# Altium schematic sheet BUTTON_LED.SchDoc
size 420 x 297 mm; SheetNumber: 22; SheetTotal: 23
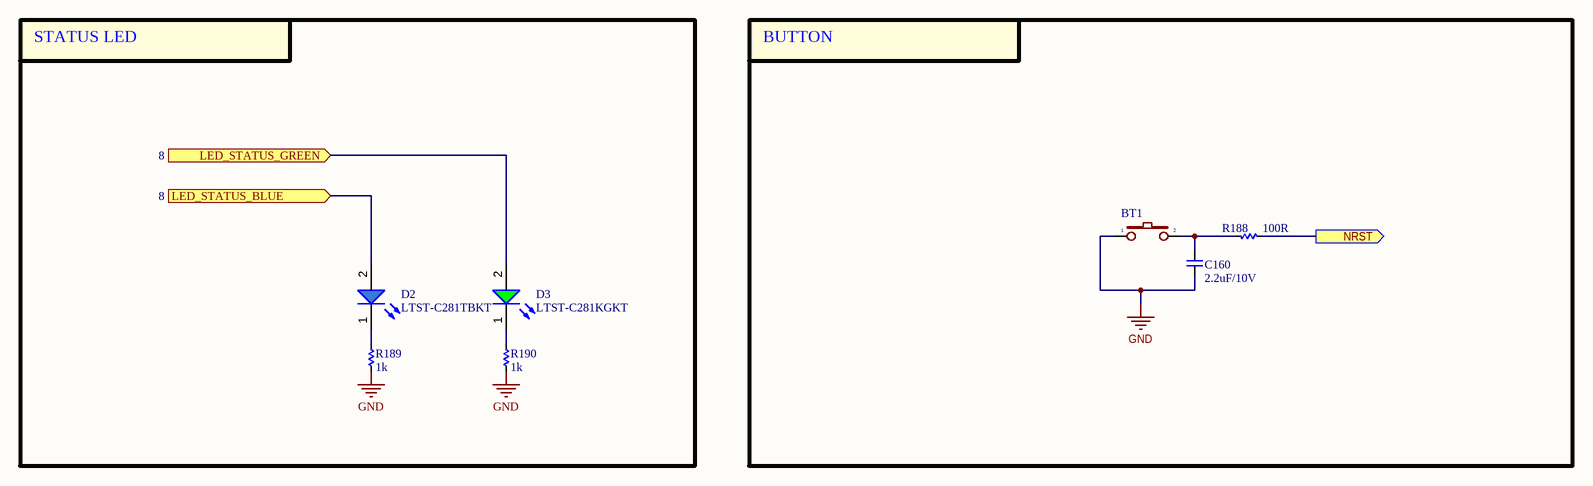
[diagram p0: BUTTON_LED.SchDoc]

## Parts
BT1  BT_  [SW2-SMD]  (value not drawn)
C160  2.2uF/10V  [CAP_C_1005X50_L]
D2  LTST-C281TBKT  [LED_0402]
D3  LTST-C281KGKT  [LED_0402]
R188  100R  [RES_C_1005x30_L]
R189  1k  [RES_C_1005x30_L]
R190  1k  [RES_C_1005x30_L]

## Blocks framed on the sheet
STATUS LED: D2 D3 R189 R190
BUTTON: BT1 C160 R188

## Ports
LED_STATUS_BLUE (in, see 8), LED_STATUS_GREEN (in, see 8), NRST (out, see 6, 7, 17)

## Nets
GND: BT1.1 C160.1 R189.1 R190.1
LED_STATUS_BLUE: D2.2(A) ; port LED_STATUS_BLUE
LED_STATUS_GREEN: D3.2(A) ; port LED_STATUS_GREEN
NRST: R188.2 ; port NRST
NetBT1_2: BT1.2 C160.2 R188.1
NetD2_1: D2.1(K) R189.2
NetD3_1: D3.1(K) R190.2

## Notes on the sheet
- Project:
- BEE-1012
- Sub-system:
- SATELLITE_EXP_CONTROLLER
- Design by:
- SANG HUYNH
- BAO BUI
- Sheet title:
- Sheet
- A3
- of
- Checked by:
- Approved by:
- VU PHAM
- Revision:
- Document No:
- Size:
- Date:

## Library data of the parts
BT1 = BT2: Switch button 2 pin; Value: SW chip 2 pin
C160 = _CAP_C_2: CAP CHIP
D2 = LED_BLUE
D3 = LED_GREEN: LED GREEN CLEAR 0402 SMD
R188-R190 = _RES_B_2: RES